# Altium schematic sheet RTC.SchDoc: Apalis Evaluation Board 1.1
size A3; Organization: Toradex AG; Address1: Altsagenstrasse 5; Address2: Horw; Address3: 6048; Address4: Switzerland; DocumentNumber: 5; Revision: V1.1; SheetNumber: 5; SheetTotal: 32; PageSetup: Record=PageOptions|CenterHorizontal=True|CenterVertical=True|PrintScale=0.73|XCorrection=1.00|YCorrection=1.00|PrintKind=0|BorderSize=5000000|LeftOffset=0|BottomOffset=0|Orientation=2|PaperLength=1000|PaperWidth=1000|Scale=100|PaperSource=7|PrintQuality=-4|MediaType=1|DitherType=10|PaperKind=A4|PrintScaleMode=1
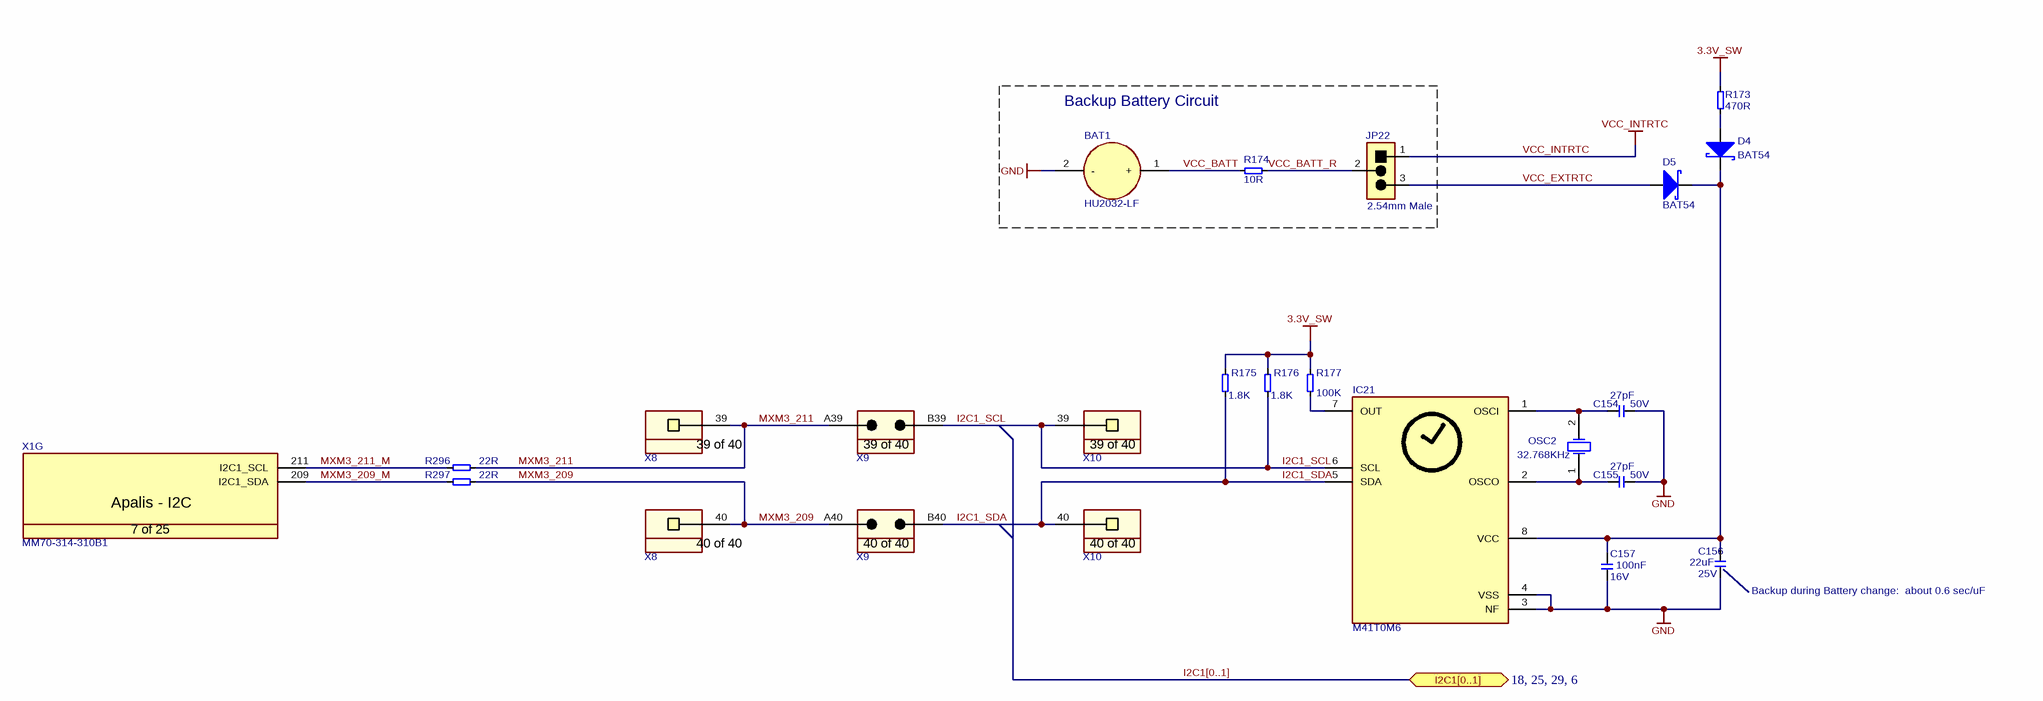
[diagram p0: RTC.SchDoc]

## Parts
BAT1  HU2032-LF  [T_Renata_HU2032-LF]
C154  Rating: 50V  [T_CAPC0603X33N]  (hidden comment: 27pF)
C155  Rating: 50V  [T_CAPC0603X33N]  (hidden comment: 27pF)
C156  Rating: 25V  [CAPC3225X160N]  (hidden comment: 22uF)
C157  Rating: 16V  [T_CAPC0603X33N]  (hidden comment: 100nF)
D4  BAT54  [SOT95P230X110-3N]
D5  BAT54  [SOT95P230X110-3N]
IC21  M41T0M6  [SOIC127P600X173-8N]
JP22  826936-3  [T_TYCO_826936-3]  (value not drawn)
OSC2  value 32.768KHz  [T_MC_CC4V-T1A]  (hidden comment: CC4V-T1A)
R173  470R  [T_RESC0603X30N]
R174  10R  [t_RESC0603X30N]
R175  1.8K  [T_RESC0603X30N]
R176  1.8K  [T_RESC0603X30N]
R177  100K  [t_RESC0603X30N]
R296  22R  [RESC1005X40N]
R297  22R  [RESC1005X40N]
X1  Manufacturer Part No.: MM70-314-310B1  [T_JAE_MM70-314-310B1]  (hidden comment: CON-JAE-MM70-314-310B1-314-0.5mm)  (part G of 25)
X8  SSW-110-01-G-S  [T_Samtec_SSW-110-01-G-S]  (value not drawn)  (parts 39,40 of 40)
X9  TSW-110-07-G-D  [T_Samtec_TSW-110-07-G-D]  (value not drawn)  (parts 39,40 of 40)
X10  SSW-110-01-G-S  [T_Samtec_SSW-110-01-G-S]  (value not drawn)  (parts 39,40 of 40)

## Blocks framed on the sheet
Backup Battery Circuit: BAT1 JP22 R174

## Ports
I2C1[0..1] (bidir, see 18, 25, 29, 6)

## Nets
3.3V_SW: R173.2 R175.2 R176.2 R177.2
GND: BAT1.2(-) C154.2 C155.2 C156.1 C157.1 IC21.3(NF) IC21.4(VSS)
VCC_INTRTC: JP22.1
I2C1_SCL: IC21.6(SCL) R176.1 X9.B39 X10.39
I2C1_SDA: IC21.5(SDA) R175.1 X9.B40 X10.40
MXM3_209: R297.2 X8.40 X9.A40
MXM3_209_M: R297.1 X1.209(I2C1_SDA)
MXM3_211: R296.2 X8.39 X9.A39
MXM3_211_M: R296.1 X1.211(I2C1_SCL)
VCC_BATT: BAT1.1(+) R174.1
VCC_BATT_R: JP22.2 R174.2
VCC_EXTRTC: D5.1 JP22.3
NetC154_1: C154.1 IC21.1(OSCI) OSC2.2(OSC2)
NetC155_1: C155.1 IC21.2(OSCO) OSC2.1(OSC1)
NetC156_2: C156.2 C157.2 D4.3 D5.3 IC21.8(VCC)
NetD4_1: D4.1 R173.1
NetIC21_7: IC21.7(OUT) R177.1

## Buses and harness runs
bus I2C1[0..1] = port I2C1[0..1]

## Notes on the sheet
- (near JP22) 2.54mm Male
- (near C156) Backup during Battery change:  about 0.6 sec/uF
- Title
- Size:
- Date:
- A3
- Number:
- Time:
- Revision:
- Sheet
- of
- File:
- (in symbol CON-JAE-MM70-314-310B1-314-0.5mm, part G) Apalis - I2C; 7 of 25
- (in symbol CON-Samtec-SSW-110-01-G-S, part 39) 39 of 40
- (in symbol CON-Samtec-SSW-110-01-G-S, part 40) 40 of 40
- (in symbol CON-Samtec-TSW-110-07-G-D, part 39) 39 of 40
- (in symbol CON-Samtec-TSW-110-07-G-D, part 40) 40 of 40

## Library data of the parts
BAT1 = BAT-Renata-HU2032-LF: C2032 Battery Holder; Manufacturer Name: Renata; Manufacturer Part No.: HU2032-LF
C154 C155 = C-NPO-27pF-50V-5%-0603: Capacitor Ceramic NPO 27pF 50V 5% 0603; Tolerance: 5%; Type: NPO; Value: 27pF
C156 = C-X5R-22uF-25V-20%-1210: Capacitor Ceramic X5R 22uF 25V 20% 1210; Tolerance: 20%; Type: X5R; Value: 22uF
C157 = C-X7R-100nF-16V-10%-0603: Capacitor Ceramic X7R 100nF 16V 10% 0603; Tolerance: 10%; Type: X7R; Value: 100nF
D4 D5 = D-Philips-BAT54-Schottky: BAT54 Schottky Diode; Manufacturer Name: Philips; Manufacturer Part No.: BAT54
IC21 = IC-ST-M41T0M6: RTC M41T0M6; Manufacturer Name: ST; Manufacturer Part No.: M41T0M6
JP22 = CON-Tyco-826936-3-1X3-2.54mm-JP_1: Jumper, 3-Pin; Manufacturer Name: Tyco; No. of ways: 1X3; Pitch: 2.54mm; Manufacturer Part No.: 826936-3
OSC2 = OSC-MC-CC4V-T1A-32.768KHz-30ppm-5x1.9mm: Quartz 32.768kHz; Manufacturer Name: Micro Crystal; Tolerance: 30ppm; Manufacturer Part No.: CC4V-T1A
R173 = R-470R-63mW-5%-0603: Resistor 470 ohm 63mW 5% 0603; Rating: 63mW; Tolerance: 5%; Value: 470R
R174 = R-10R-63mW-5%-0603: Resistor 10 ohm 63mW 5% 0603; Rating: 63mW; Tolerance: 5%; Value: 10R
R175 R176 = R-1.8KR-63mW-5%-0603: Resistor 1.8 Kohm 63mW 5% 0603; Value: 1.8KR; Rating: 63mW; Tolerance: 5%
R177 = R-100KR-63mW-5%-0603: Resistor 100 Kohm 63mW 5% 0603; Value: 100KR; Rating: 63mW; Tolerance: 5%
R296 R297 = R-22R-63mW-5%-0402: Resistor 22 ohm 63mW 5% 0402; Rating: 63mW; Tolerance: 5%; Value: 22R
X1 = CON-JAE-MM70-314-310B1-314-0.5mm: MXM3 Connector; Manufacturer Name: JAE; No. of ways: 314
X8 X10 = CON-Samtec-SSW-110-01-G-S: Receptacle Female Socket 1x40 pin 2.54mm pitch; Manufacturer Name: Samtec; Pitch: 2.54mm; No. of ways: 1x40; Manufacturer Part No.: SSW-110-01-G-S
X9 = CON-Samtec-TSW-110-07-G-D: Header 2x40 pin 2.54mm pitch; Manufacturer Name: Samtec; Pitch: 2.54mm; No. of ways: 2x40; Manufacturer Part No.: TSW-110-07-G-D